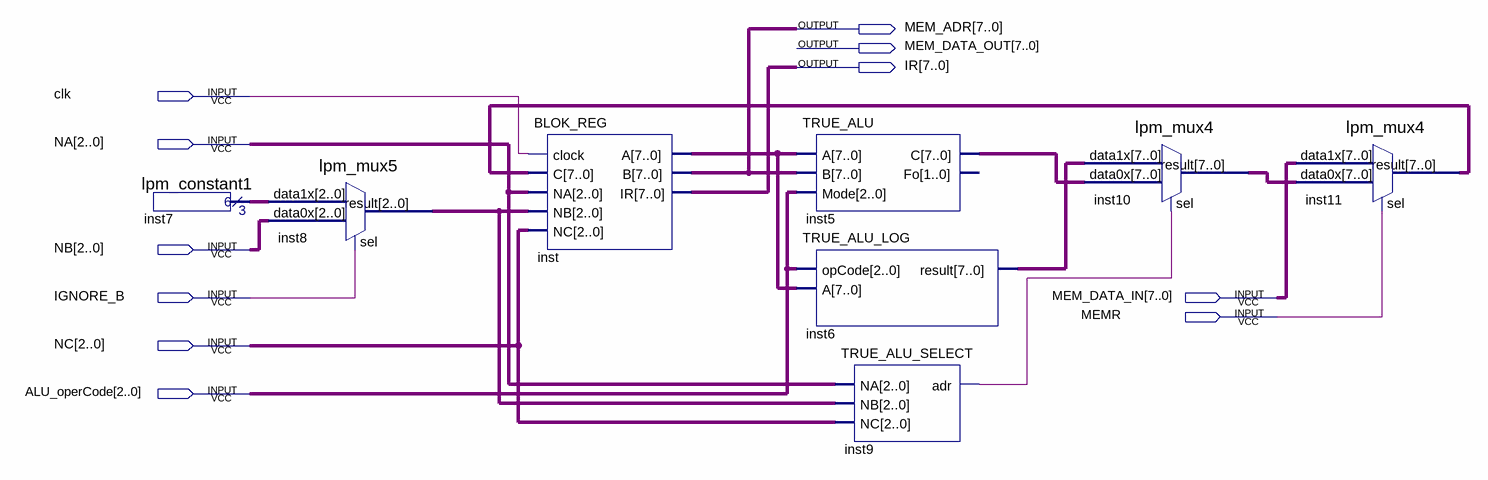
[diagram p0: schematic sheet]
// Quartus schematic OU.bdf as structural Verilog: 8 symbols, 11 pins
module OU (
  input  clk,
  input  [2:0] NA,
  input  [2:0] NB,
  input  IGNORE_B,
  input  [7:0] MEM_DATA_IN,
  input  MEMR,
  input  [2:0] NC,
  input  [2:0] ALU_operCode,
  output [7:0] MEM_ADR,
  output [7:0] MEM_DATA_OUT,
  output [7:0] IR
);

  wire inst9_adr;
  wire [2:0] inst7_result, inst8_result;
  wire [7:0] inst5_c, inst6_result, inst10_result, inst11_result, inst_a;

  lpm_constant1 inst7 (.result(inst7_result));
  lpm_mux5 inst8 (.data1x(inst7_result), .data0x(NB), .sel(IGNORE_B), .result(inst8_result));
  BLOK_REG inst (.clock(clk), .C(inst11_result), .NA(NA), .NB(inst8_result), .NC(NC), .A(inst_a), .B(MEM_ADR), .IR(IR));
  TRUE_ALU inst5 (.A(inst_a), .B(MEM_ADR), .Mode(ALU_operCode), .C(inst5_c));  // open: Fo
  TRUE_ALU_LOG inst6 (.opCode(ALU_operCode), .A(inst_a), .result(inst6_result));
  TRUE_ALU_SELECT inst9 (.NA(NA), .NB(inst8_result), .NC(NC), .adr(inst9_adr));
  lpm_mux4 inst10 (.data1x(inst6_result), .data0x(inst5_c), .sel(inst9_adr), .result(inst10_result));
  lpm_mux4 inst11 (.data1x(MEM_DATA_IN), .data0x(inst10_result), .sel(MEMR), .result(inst11_result));
endmodule
